# Altium schematic sheet trippot.SchDoc
size A4
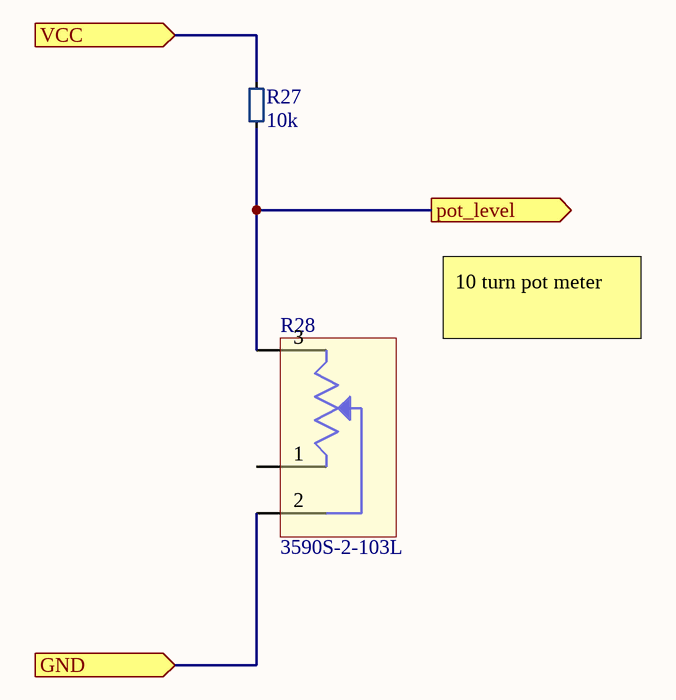
[diagram p0: trippot.SchDoc]

## Parts
R27  Resistance: 10k  [SMD_0402(1005)_M]  (hidden comment: RC0402FR-0710KL)
R28  3590S-2-103L  [3590S-2-103L-Footprint-1]

## Ports
GND (in), pot_level (out), VCC (in)

## Nets
GND: R28.2 ; port GND
pot_level: R27.1 R28.3 ; port pot_level
VCC: R27.2 ; port VCC

Not connected (* = marked no-connect by the designer): R28 1(13)

## Notes on the sheet
- 10 turn pot meter

## Library data of the parts
R27 = CMP-008-0005-9: Surface Mount Thick Film Resistor, Rc Series, 10 Kohm, 62.5 Mw, - 1%, 50 V, 0402 [1005 Metric]; Voltage Rating: 50V; Temperature Coefficient: 100ppm/°C; Power Rating: 62.5mW; Value: 10k; Case/Package: 0402; Lead Free: Lead Free; Case Code (Imperial): 0402; Termination: SMD/SMT; Max Operating Temperature: 155°C; Height: 0.32mm; Length: 1mm; Min Operating Temperature: -55°C; Case Code (Metric): 1005; Depth: 0.5mm; Mount: SMD; REACH SVHC: No SVHC; Military Standard: Not; Tolerance: 1%; Number of Pins: 2; Voltage Rating (DC): 50V; Composition: Thick Film; RoHS: Yes; Packaging: Tape and Reel; Width: 0.5mm; Lead Pitch: 0.2mm; Working Voltage: 50V; Number of Terminations: 2
R28 = CMP-0001-00004-6: Res Wirewound POT 10K Ohm 5% 2W 10(Elec)/10(Mech)Turn 6.34mm (39.22 X 22.23 X 26.66mm) Solder Lug Panel Mount; Number of Gangs: 1; Value: 100k; Temperature Coefficient: 50ppm/°C; Ratings: IP40; Voltage Rating (AC): 450V; Linearity: 0.25%; Actuator Diameter: 0.2497inch; Voltage Rating (DC): 500V; Number of Turns: 10; Actuator Length: 0.812inch; Insulation Resistance: 1GR; Radiation Hardening: No; Resistance: 10k; Height: 26.66mm; Diameter: 22.23mm; Contact Plating: Tin,Matte; Type: Potentiometer; Min Operating Temperature: -40°C; Power Rating: 2W; Weight: 0.670205oz; Taper: Linear; REACH SVHC: No SVHC; Mount: Panel; Composition: Wirewound; Tolerance: 5%; Package Quantity: 25; RoHS: Yes; Length: 39.22mm; Max Power Dissipation: 2W; Max Operating Temperature: 125°C; Termination: Solder; Packaging: Bulk; Lead Free: Lead Free; Case/Package: dip; Depth: 22.23mm; Military Standard: Not